# Altium schematic sheet MSP430.SchDoc
size A
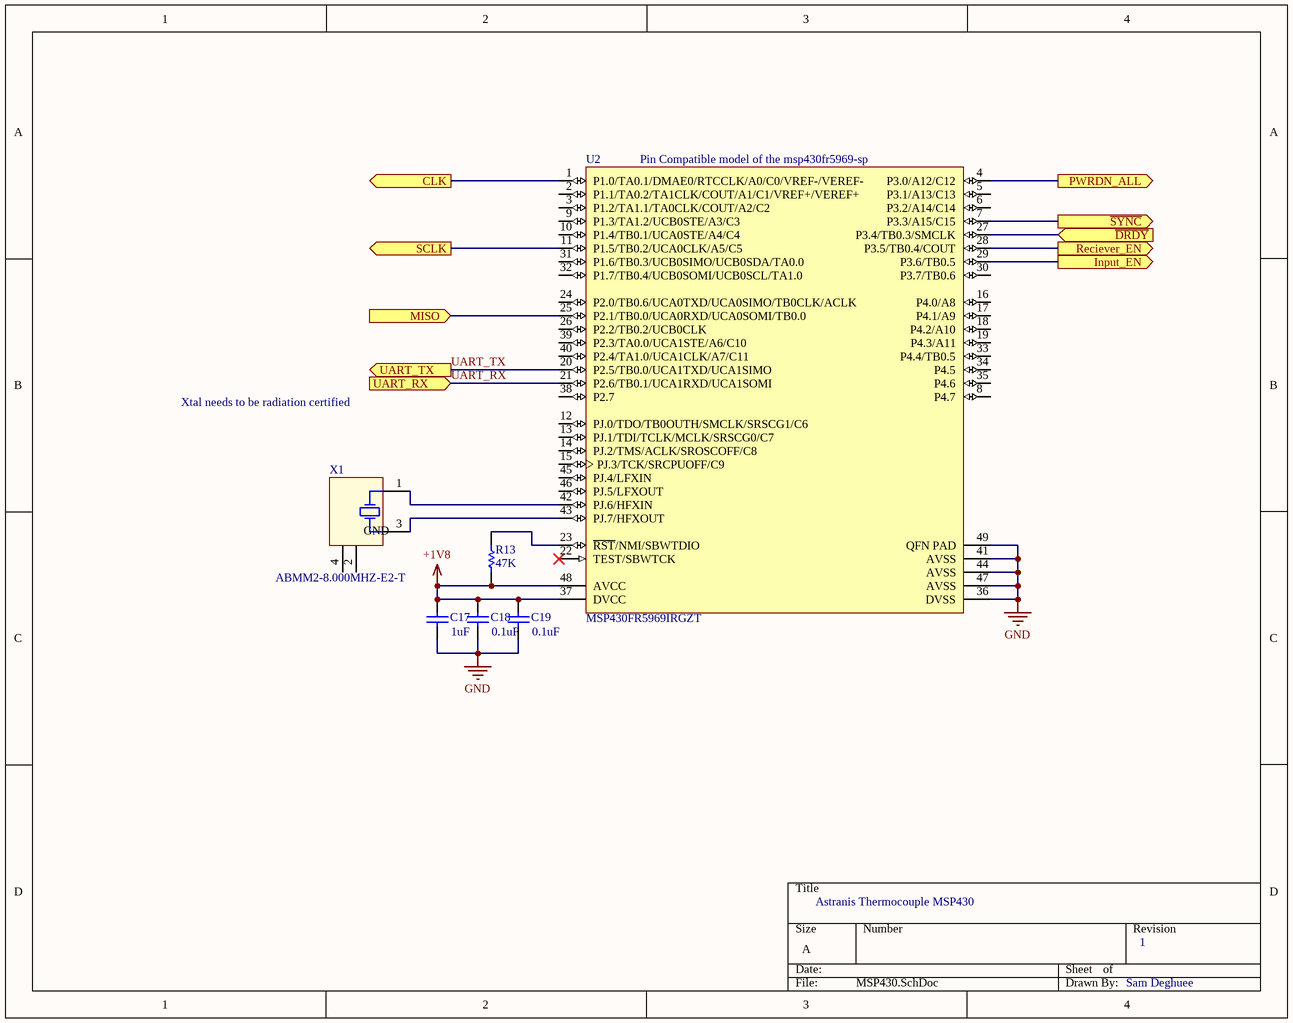
[diagram p0: MSP430.SchDoc]

## Parts
C17  value 1uF  [CAPC0603(1608)100_L]  (hidden comment: CAP0603)
C18  value 0.1uF  [CAPC0603(1608)100_L]  (hidden comment: CAP0603)
C19  value 0.1uF  [CAPC0603(1608)100_L]  (hidden comment: CAP0603)
R13  value 47K  [RESC0603(1608)_L]  (hidden comment: RES0603)
U2  MSP430FR5969IRGZT  [RGZ0048B_V]
X1  ABMM2-8.000MHZ-E2-T  [ABRA-ABMM2-4_V]

## Ports
CLK (out), Input_EN (out), MISO (in), PWRDN_ALL (out), Reciever_EN (out), SCLK (out), UART_RX (in), UART_TX (out), ~{DRDY} (in), ~{SYNC} (out)

## Nets
+1V8: C17.2 C18.2 C19.2 R13.2 U2.37(DVCC) U2.48(AVCC)
GND: C17.1 C18.1 C19.1 U2.36(DVSS) U2.41(AVSS) U2.44(AVSS) U2.47(AVSS) U2.49(QFN_PAD)
CLK: U2.1(P1.0/TA0.1/DMAE0/RTCCLK/A0/C0/VREF-/VEREF-) ; port CLK
~{DRDY}: U2.27(P3.4/TB0.3/SMCLK) ; port ~{DRDY}
Input_EN: U2.29(P3.6/TB0.5) ; port Input_EN
MISO: U2.25(P2.1/TB0.0/UCA0RXD/UCA0SOMI/TB0.0) ; port MISO
PWRDN_ALL: U2.4(P3.0/A12/C12) ; port PWRDN_ALL
Reciever_EN: U2.28(P3.5/TB0.4/COUT) ; port Reciever_EN
~{SYNC}: U2.7(P3.3/A15/C15) ; port ~{SYNC}
SCLK: U2.11(P1.5/TB0.2/UCA0CLK/A5/C5) ; port SCLK
UART_RX: U2.21(P2.6/TB0.1/UCA1RXD/UCA1SOMI) ; port UART_RX
UART_TX: U2.20(P2.5/TB0.0/UCA1TXD/UCA1SIMO) ; port UART_TX
NetR13_1: R13.1 U2.23(~{RST}/NMI/SBWTDIO)
NetU2_42: U2.42(PJ.6/HFXIN) X1.1(X1)
NetU2_43: U2.43(PJ.7/HFXOUT) X1.3(X2)

Not connected (* = marked no-connect by the designer): U2 2(P1.1/TA0.2/TA1CLK/COUT/A1/C1/VREF+/VEREF+) 3(P1.2/TA1.1/TA0CLK/COUT/A2/C2) 5(P3.1/A13/C13) 6(P3.2/A14/C14) 8(P4.7) 9(P1.3/TA1.2/UCB0STE/A3/C3) 10(P1.4/TB0.1/UCA0STE/A4/C4) 12(PJ.0/TDO/TB0OUTH/SMCLK/SRSCG1/C6) 13(PJ.1/TDI/TCLK/MCLK/SRSCG0/C7) 14(PJ.2/TMS/ACLK/SROSCOFF/C8) 15(PJ.3/TCK/SRCPUOFF/C9) 16(P4.0/A8) 17(P4.1/A9) 18(P4.2/A10) 19(P4.3/A11) 22(TEST/SBWTCK)* 24(P2.0/TB0.6/UCA0TXD/UCA0SIMO/TB0CLK/ACLK) 26(P2.2/TB0.2/UCB0CLK) 30(P3.7/TB0.6) 31(P1.6/TB0.3/UCB0SIMO/UCB0SDA/TA0.0) 32(P1.7/TB0.4/UCB0SOMI/UCB0SCL/TA1.0) 33(P4.4/TB0.5) 34(P4.5) 35(P4.6) 38(P2.7) 39(P2.3/TA0.0/UCA1STE/A6/C10) 40(P2.4/TA1.0/UCA1CLK/A7/C11) 45(PJ.4/LFXIN) 46(PJ.5/LFXOUT); X1 2(GND) 4(GND)

## Notes on the sheet
- (near U2) Pin Compatible model of the msp430fr5969-sp
- Xtal needs to be radiation certified
- Astranis Thermocouple MSP430
- 1
- Sam Deghuee

## Library data of the parts
C17-C19 = CMP-1590-00005-1: 0603 (1608 Metric) Chip Capacitor; Case-Metric: 1608; Case-EIA: 0603; PackageReference: CAPC0603(1608)100
R13 = CMP-1591-00001-1: 0603 (1608 Metric) Chip Resistor; Case-Metric: 1608; Case-EIA: 0603; PackageReference: RESC0603(1608)
U2 = CMP-2000-06762-1: 16 MHz Mixed Signal Microcontroller with 2 KB SRAM and 40 GPIOs, -40 to 85 degC, 48-Pin QFN (RGZ), Green (RoHS & no Sb/Br), Tape and Reel; Manufacturer: Texas Instruments; Maximum Frequency: 16MHz; Number of SPI Channels: 3; ADC Channels: 16; Device Core: MSP430; ADC Resolution: 12bit; Program Memory Size: 64kB; Number of UART Channels: 2; ADCs: 1(16x12bit); Data Bus Width: 16bit; Number of ADC Units: 1; Timers: 5x16bit; Instruction Set Architecture: RISC; Program Memory Type: Flash; RAM Size: 2kB; Typical Operating Supply Voltage: 1.8→3.6V; Number of Timers: 5; Pin Count: 48; Width: 7.15mm; Package Type: VQFN; Minimum Operating Temperature: -40°C; Maximum Operating Temperature: +85°C; Datasheet URL: http://www.ti.com/lit/ds/symlink/msp430fr5969.pdf; Mounting Type: SurfaceMount; Package Description: 48-Pin Quad Flat No-lead Package, Body 7 x 7 mm, Pitch 0.5 mm; Timer Resolution: 16bit; Manufacturer URL: http://www.ti.com/; Height: 0.95mm; Datasheet Version: Rev. E, 03/2015; Dimensions: 7.15x7.15x0.95mm; Mounting Technology: SurfaceMount; Package Reference: RGZ48-4100X4100TP; Number of I2C Channels: 1; Family Name: MSP430; Length: 7.15mm; Number of LIN Channels: 2; ComponentLink1Description: Space Datasheet; ComponentLink1URL: http://www.ti.com/lit/ds/symlink/msp430fr5969-sp.pdf
X1 = CMP-0277-00003-1: Ceramic Surface Mount Low Profile Quartz Crystal, 8 MHz, -20 to 70 degC, 4-Pin 6 x 3.6 x 1.2 mm SMD, RoHS, 1000pcs / Reel; Manufacturer: Abracon; ESR: 72 Ohm Max.; Frequency: 8 MHz; Shunt Capacitance C0: 7 pF Max.; Load Capacitance CL: 18 pF Typ.; ComponentLink3Description: Package Specification; PackageDescription: 4-Pin SMD, Body 6 x 3.6 mm, Pitch 4.4 mm; DatasheetVersion: Jan-13; ComponentLink1URL: http://www.abracon.com/; ComponentLink2URL: http://www.abracon.com/Resonators/ABMM2.pdf; Temperature Range: -20 to 70 degC; Mounting Technology: Surface Mount; RoHS: TRUE; PartNumber: ABMM2-8.000MHZ-E2-T; ComponentLink2Description: Datasheet; ComponentLink3URL: http://www.abracon.com/Resonators/ABMM2.pdf; ComponentLink1Description: Manufacturer URL; Packing: 1000pcs / Reel